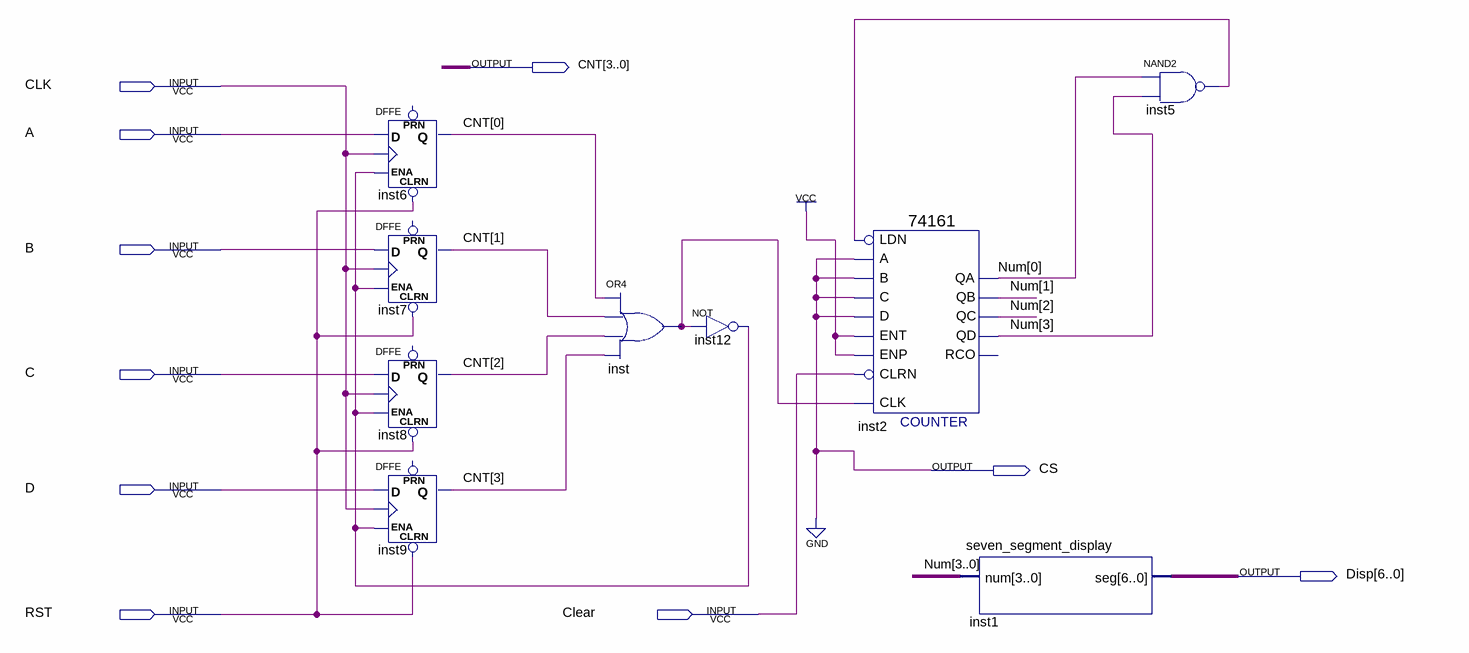
[diagram p0: schematic sheet]
// Quartus schematic Final.bdf as structural Verilog: 9 symbols, 10 pins
module Final (
  input  CLK,
  input  A,
  input  B,
  input  C,
  input  D,
  input  RST,
  input  Clear,
  output [3:0] CNT,
  output CS,
  output [6:0] Disp
);

  wire inst5_out, inst12_out, inst_out;
  wire [3:0] Num;

  DFFE inst6 (.CLRN(RST), .D(A), .CLK(CLK), .ENA(inst12_out), .Q(CNT[0]));  // open: PRN
  DFFE inst7 (.CLRN(RST), .D(B), .CLK(CLK), .ENA(inst12_out), .Q(CNT[1]));  // open: PRN
  DFFE inst8 (.CLRN(RST), .D(C), .CLK(CLK), .ENA(inst12_out), .Q(CNT[2]));  // open: PRN
  DFFE inst9 (.CLRN(RST), .D(D), .CLK(CLK), .ENA(inst12_out), .Q(CNT[3]));  // open: PRN
  or inst (inst_out, CNT[0], CNT[1], CNT[2], CNT[3]);
  not inst12 (inst12_out, inst_out);
  \74161  inst2 (
    .CLRN(Clear), .CLK(inst_out), .ENP(1'b1), .LDN(inst5_out), .A(1'b0), .D(1'b0), .ENT(1'b1), .B(1'b0),
    .C(1'b0), .QD(Num[3]), .QC(Num[2]), .QB(Num[1]), .QA(Num[0]));  // open: RCO
  seven_segment_display inst1 (.num(Num), .seg(Disp));
  nand inst5 (inst5_out, Num[0], Num[3]);

  assign CS = 1'b0;
endmodule
